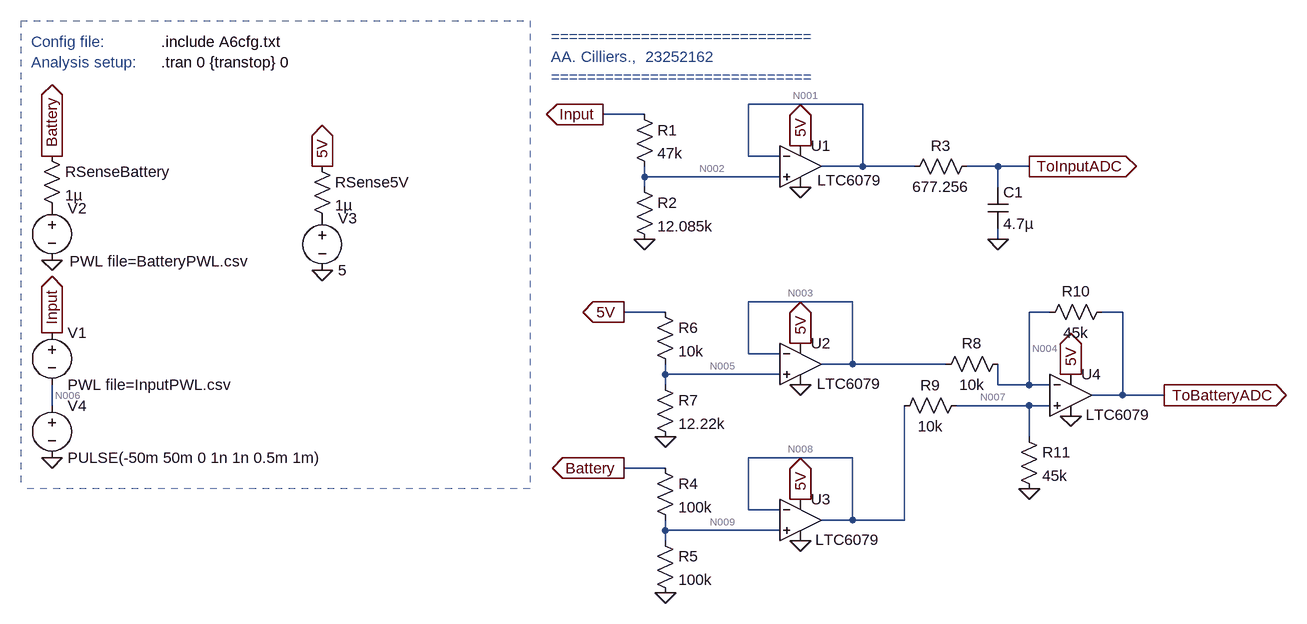
[diagram p0: schematic E344_23252162_A6.asc]
E344_23252162_A6.asc, the LTspice schematic file:
Version 4
SHEET 1 1824 680
WIRE -1072 -1296 -1248 -1296
WIRE -1408 -1280 -1472 -1280
WIRE -1248 -1216 -1248 -1296
WIRE -1200 -1216 -1248 -1216
WIRE -1072 -1200 -1072 -1296
WIRE -1072 -1200 -1136 -1200
WIRE -992 -1200 -1072 -1200
WIRE -864 -1200 -912 -1200
WIRE -816 -1200 -864 -1200
WIRE -1408 -1184 -1408 -1200
WIRE -1200 -1184 -1408 -1184
WIRE -1408 -1168 -1408 -1184
WIRE -864 -1168 -864 -1200
WIRE -864 -1088 -864 -1104
WIRE -1088 -992 -1248 -992
WIRE -1376 -976 -1440 -976
WIRE -784 -976 -816 -976
WIRE -672 -976 -704 -976
WIRE -1248 -912 -1248 -992
WIRE -1200 -912 -1248 -912
WIRE -1088 -896 -1088 -992
WIRE -1088 -896 -1136 -896
WIRE -944 -896 -1088 -896
WIRE -1376 -880 -1376 -896
WIRE -1200 -880 -1376 -880
WIRE -1376 -864 -1376 -880
WIRE -864 -864 -864 -896
WIRE -816 -864 -816 -976
WIRE -816 -864 -864 -864
WIRE -784 -864 -816 -864
WIRE -672 -848 -672 -976
WIRE -672 -848 -720 -848
WIRE -608 -848 -672 -848
WIRE -2320 -832 -2320 -864
WIRE -816 -832 -928 -832
WIRE -784 -832 -816 -832
WIRE -816 -784 -816 -832
WIRE -1088 -752 -1248 -752
WIRE -1376 -736 -1440 -736
WIRE -1248 -672 -1248 -752
WIRE -1200 -672 -1248 -672
WIRE -1088 -656 -1088 -752
WIRE -1088 -656 -1136 -656
WIRE -1008 -656 -1008 -832
WIRE -1008 -656 -1088 -656
WIRE -1376 -640 -1376 -656
WIRE -1200 -640 -1376 -640
WIRE -1376 -624 -1376 -640
FLAG -2320 -944 Input
IOPIN -2320 -944 Out
FLAG -1904 -1040 0
FLAG -1168 -1168 0
FLAG -2320 -752 0
FLAG -2320 -1056 0
FLAG -816 -1200 ToInputADC
IOPIN -816 -1200 Out
FLAG -608 -848 ToBatteryADC
IOPIN -608 -848 Out
FLAG -1904 -1200 5V
IOPIN -1904 -1200 Out
FLAG -2320 -1216 Battery
IOPIN -2320 -1216 Out
FLAG -1440 -736 Battery
IOPIN -1440 -736 Out
FLAG -1472 -1280 Input
IOPIN -1472 -1280 Out
FLAG -1440 -976 5V
IOPIN -1440 -976 Out
FLAG -1408 -1088 0
FLAG -1168 -1232 5V
IOPIN -1168 -1232 Out
FLAG -864 -1088 0
FLAG -1376 -544 0
FLAG -1376 -784 0
FLAG -1168 -928 5V
IOPIN -1168 -928 Out
FLAG -1168 -688 5V
IOPIN -1168 -688 Out
FLAG -1168 -864 0
FLAG -1168 -624 0
FLAG -816 -704 0
FLAG -752 -880 5V
IOPIN -752 -880 Out
FLAG -752 -816 0
SYMBOL voltage -2320 -960 R0
WINDOW 123 0 0 Left 0
WINDOW 39 0 0 Left 0
SYMATTR InstName V1
SYMATTR Value PWL file=InputPWL.csv
SYMBOL voltage -2320 -1152 R0
WINDOW 123 0 0 Left 0
WINDOW 39 0 0 Left 0
WINDOW 3 27 98 Left 2
SYMATTR Value PWL file=BatteryPWL.csv
SYMATTR InstName V2
SYMBOL voltage -1904 -1136 R0
WINDOW 123 0 0 Left 0
WINDOW 39 0 0 Left 0
SYMATTR InstName V3
SYMATTR Value 5
SYMBOL voltage -2320 -848 R0
WINDOW 123 0 0 Left 0
WINDOW 39 0 0 Left 0
SYMATTR InstName V4
SYMATTR Value PULSE(-50m 50m 0 1n 1n 0.5m 1m)
SYMBOL res -1920 -1216 R0
SYMATTR InstName RSense5V
SYMATTR Value 1µ
SYMBOL res -2336 -1232 R0
SYMATTR InstName RSenseBattery
SYMATTR Value 1µ
SYMBOL OpAmps\\LTC6079 -1168 -1200 R0
WINDOW 3 26 21 Left 2
SYMATTR InstName U1
SYMBOL OpAmps\\LTC6079 -1168 -896 R0
WINDOW 3 25 30 Left 2
SYMATTR InstName U2
SYMBOL OpAmps\\LTC6079 -1168 -656 R0
WINDOW 3 23 30 Left 2
SYMATTR InstName U3
SYMBOL res -1424 -1296 R0
SYMATTR InstName R1
SYMATTR Value 47k
SYMBOL res -1424 -1184 R0
SYMATTR InstName R2
SYMATTR Value 12.085k
SYMBOL res -896 -1216 R90
WINDOW 0 0 56 VBottom 2
WINDOW 3 32 56 VTop 2
SYMATTR InstName R3
SYMATTR Value 677.256
SYMBOL cap -880 -1168 R0
SYMATTR InstName C1
SYMATTR Value 4.7µ
SYMBOL res -1392 -752 R0
SYMATTR InstName R4
SYMATTR Value 100k
SYMBOL res -1392 -640 R0
SYMATTR InstName R5
SYMATTR Value 100k
SYMBOL res -1392 -992 R0
SYMATTR InstName R6
SYMATTR Value 10k
SYMBOL res -1392 -880 R0
SYMATTR InstName R7
SYMATTR Value 12.22k
SYMBOL OpAmps\\LTC6079 -752 -848 R0
WINDOW 3 23 30 Left 2
SYMATTR InstName U4
SYMBOL res -848 -912 R90
WINDOW 0 0 56 VBottom 2
WINDOW 3 32 56 VTop 2
SYMATTR InstName R8
SYMATTR Value 10k
SYMBOL res -912 -848 R90
WINDOW 0 0 56 VBottom 2
WINDOW 3 32 56 VTop 2
SYMATTR InstName R9
SYMATTR Value 10k
SYMBOL res -688 -992 R90
WINDOW 0 0 56 VBottom 2
WINDOW 3 32 56 VTop 2
SYMATTR InstName R10
SYMATTR Value 45k
SYMBOL res -832 -800 R0
SYMATTR InstName R11
SYMATTR Value 45k
TEXT -2152 -1360 Left 2 !.tran 0 {transtop} 0
TEXT -2152 -1392 Left 2 !.include A6cfg.txt
TEXT -2352 -1392 Left 2 ;Config file:
TEXT -2352 -1360 Left 2 ;Analysis setup:
TEXT -1552 -1400 Left 2 ;=============================\nAA. Cilliers.,  23252162\n=============================
LINE Normal -1584 -1424 -1584 -704 2
LINE Normal -2368 -1424 -1584 -1424 2
LINE Normal -1584 -704 -2368 -704 2
LINE Normal -1584 -720 -1584 -720 2
LINE Normal -2368 -1424 -2368 -704 2

The netlist it stands for:
* E344_23252162_A6.asc
V1 Input N006 PWL file=InputPWL.csv
V2 P001 0 PWL file=BatteryPWL.csv
V3 P002 0 5
V4 N006 0 PULSE(-50m 50m 0 1n 1n 0.5m 1m)
RSense5V 5V P002 1µ
RSenseBattery Battery P001 1µ
XU1 N002 N001 5V 0 N001 LTC6078  ; LTC6079, pins In+ In- V+ V- OUT
XU2 N005 N003 5V 0 N003 LTC6078  ; LTC6079, pins In+ In- V+ V- OUT
XU3 N009 N008 5V 0 N008 LTC6078  ; LTC6079, pins In+ In- V+ V- OUT
R1 Input N002 47k
R2 N002 0 12.085k
R3 ToInputADC N001 677.256
C1 ToInputADC 0 4.7µ
R4 Battery N009 100k
R5 N009 0 100k
R6 5V N005 10k
R7 N005 0 12.22k
XU4 N007 N004 5V 0 ToBatteryADC LTC6078  ; LTC6079, pins In+ In- V+ V- OUT
R8 N004 N003 10k
R9 N007 N008 10k
R10 ToBatteryADC N004 45k
R11 N007 0 45k
.tran 0 {transtop} 0
.include A6cfg.txt
* Config file:
* Analysis setup:
* =============================
* AA. Cilliers.,  23252162
* =============================
.lib LTC5.lib
.backanno
.end

* Results of the author's LTspice run, read from the files saved beside the schematic
* Operating Point, zero values left out:
*   V(input) = -50 mV
*   V(n006) = -50 mV
*   V(p001) = 5.7 V
*   V(p002) = 5 V
*   V(5v) = 5 V
*   V(battery) = 5.7 V
*   V(n002) = -10.23 mV
*   V(n001) = 26.49 µV
*   V(n005) = 2.75 V
*   V(n003) = 2.75 V
*   V(n009) = 2.85 V
*   V(n008) = 2.85 V
*   V(toinputadc) = 26.49 µV
*   V(n007) = 2.332 V
*   V(n004) = 2.332 V
*   V(tobatteryadc) = 451 mV
*   I(R11) = 51.82 µA
*   I(R10) = -41.8 µA
*   I(R9) = -51.82 µA
*   I(R8) = -41.8 µA
*   I(R7) = 225 µA
*   I(R6) = 225 µA
*   I(R5) = 28.5 µA
*   I(R4) = 28.5 µA
*   I(R2) = -846.2 nA
*   I(R1) = -846.2 nA
*   I(Rsensebattery) = -28.5 µA
*   I(Rsense5v) = -479.7 µA
*   I(V4) = 846.2 nA
*   I(V3) = -479.7 µA
*   I(V2) = -28.5 µA
*   I(V1) = 846.2 nA